# EAGLE design CORESP12 (EAGLE 6.5.0)
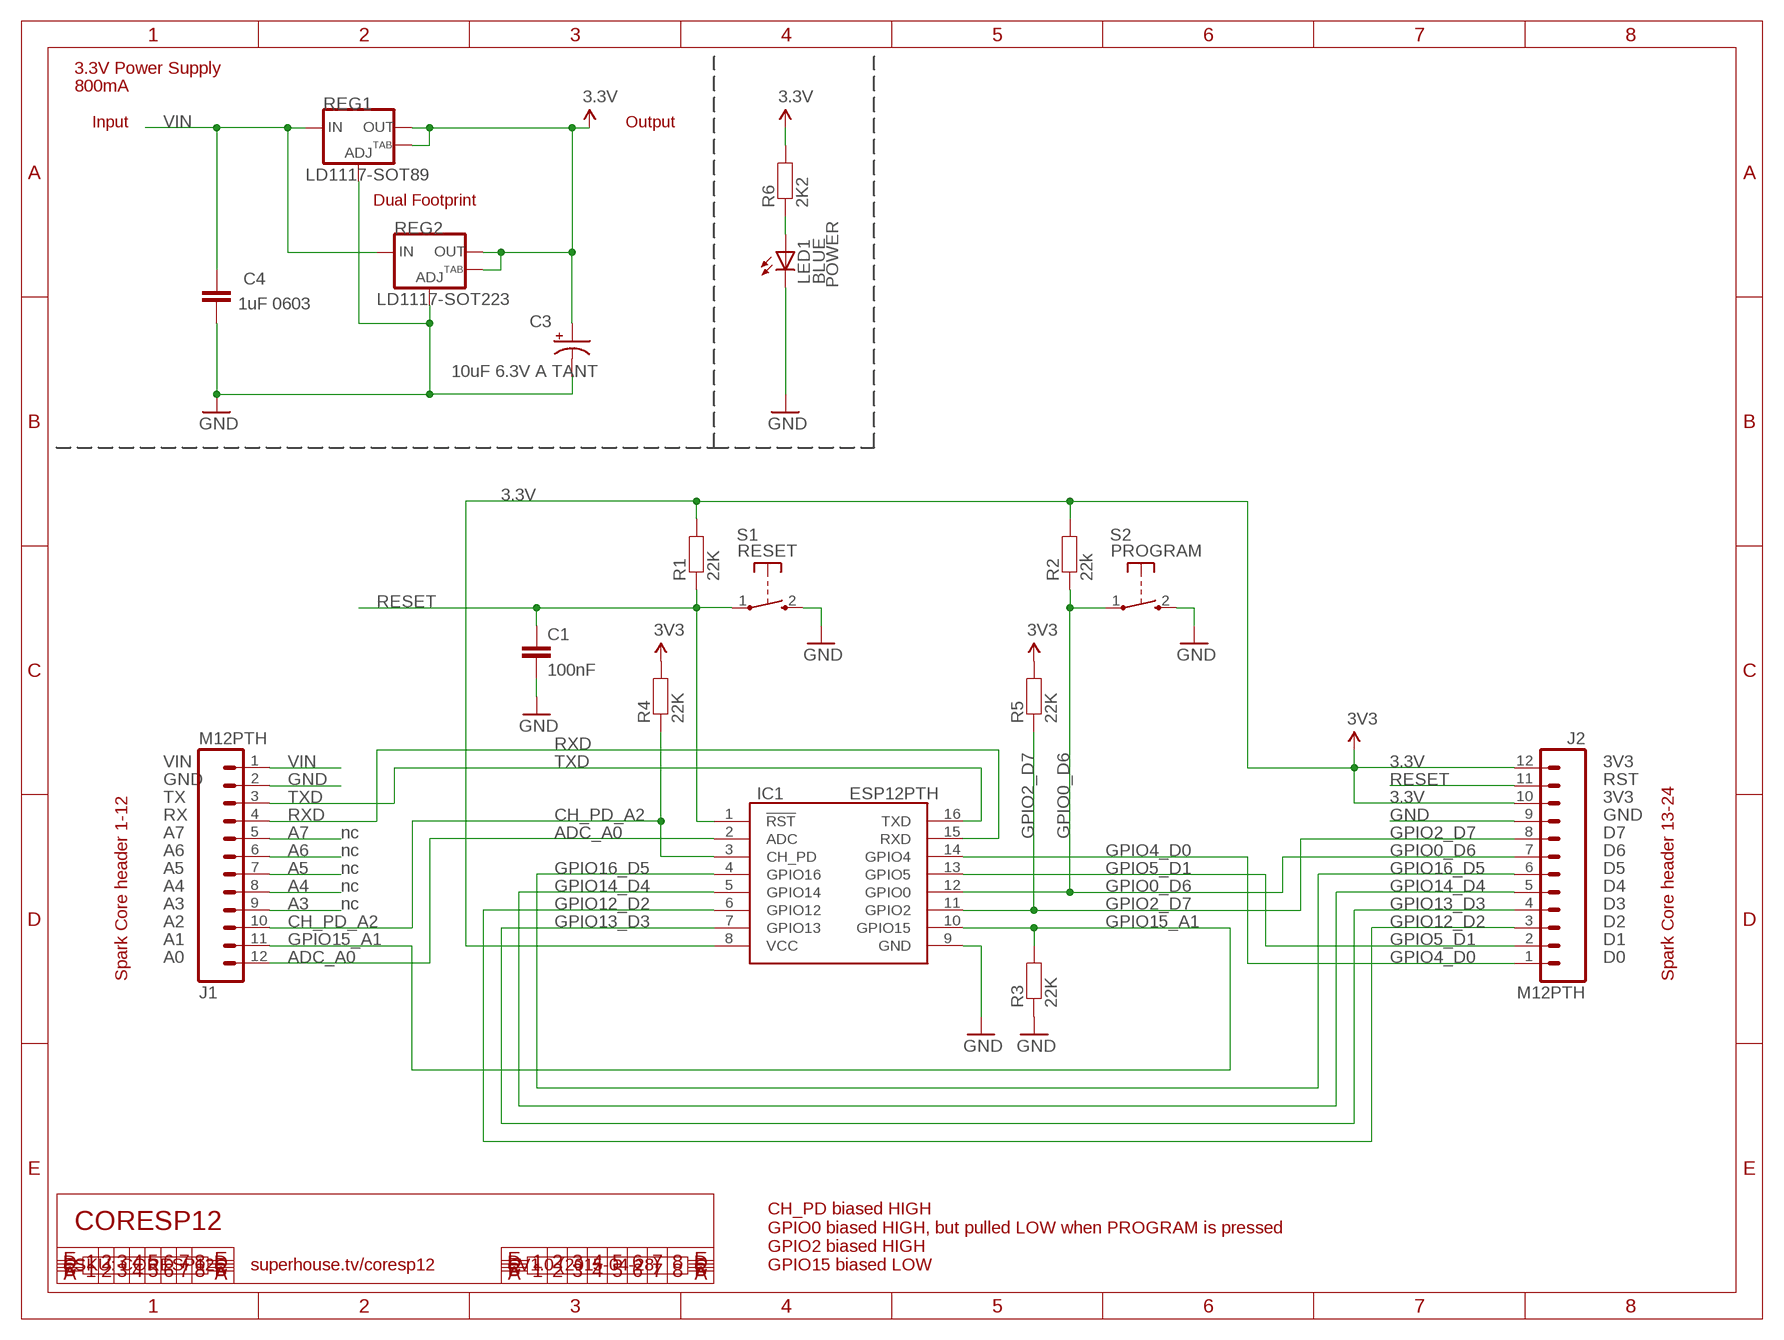
[diagram p0: schematic, sheet 1]

## Parts
C1  100nF  CAP0603  [0603]
C3  10uF 6.3V A TANT  CAP_POL1206  [EIA3216]
C4  1uF 0603  CAP0603  [0603]
IC1  ESP12PTH  [ESP12PTH]
J1  M12PTH  [1X12]
J2  M12PTH  [1X12]
LED1  BLUE  LED0603  [LED-0603]
R1  22K  RESISTOR0603  [0603]
R2  22k  RESISTOR0603  [0603]
R3  22K  RESISTOR0603  [0603]
R4  22K  RESISTOR0603  [0603]
R5  22K  RESISTOR0603  [0603]
R6  2K2  RESISTOR0603  [0603]
REG1  LD1117-SOT89  V_REG_LM1117SOT89  [SOT89]
REG2  LD1117-SOT223  V_REG_LM1117SOT223  [SOT223]
S1  RESET  TAC_SWITCH_2PIN  [TACTILE_SWITCH_SMD_2PIN_TINY]
S2  PROGRAM  TAC_SWITCH_2PIN  [TACTILE_SWITCH_SMD_2PIN_TINY]

## Nets
3.3V: C3.A(+) IC1.8(VCC) J2.10 J2.12 R1.2 R2.2 R4.2 R5.2 R6.2 REG1.2(OUT) REG1.4(OUT) REG2.2(OUT) REG2.4(OUT) ; supply symbol labelled 3V3
A3: J1.9
A4: J1.8
A5: J1.7
A6: J1.6
A7: J1.5
ADC_A0: IC1.2(ADC) J1.12
CH_PD_A2: IC1.3(CH_PD) J1.10 R4.1
GND: C1.2 C3.C(-) C4.2 IC1.9(GND) J1.2 J2.9 LED1.C R3.1 REG1.1(ADJ) REG2.1(ADJ) S1.2(S) S2.2(S)
GPIO0_D6: IC1.12(GPIO0) J2.7 R2.1 S2.1(P)
GPIO2_D7: IC1.11(GPIO2) J2.8 R5.1
GPIO4_D0: IC1.14(GPIO4) J2.1
GPIO5_D1: IC1.13(GPIO5) J2.2
GPIO12_D2: IC1.6(GPIO12) J2.3
GPIO13_D3: IC1.7(GPIO13) J2.4
GPIO14_D4: IC1.5(GPIO14) J2.5
GPIO15_A1: IC1.10(GPIO15) J1.11 R3.2
GPIO16_D5: IC1.4(GPIO16) J2.6
N$14: LED1.A R6.1
RESET: C1.1 IC1.1(!RST) J2.11 R1.1 S1.1(P)
RXD: IC1.15(RXD) J1.4
TXD: IC1.16(TXD) J1.3
VIN: C4.1 J1.1 REG1.3(IN) REG2.3(IN)

## Notes on the sheet
- 3.3V Power Supply
- 800mA
- Input | Output
- Dual Footprint
- POWER
- VIN | 3V3
- GND | RST
- TX | 3V3
- RX | GND
- A7 | nc | D7
- A6 | nc | D6
- A5 | nc | D5
- A4 | nc | D4
- A3 | nc | D3
- A2 | D2
- A1 | D1
- A0 | D0
- Spark Core header 1-12 | Spark Core header 13-24
- CORESP12
- SKU: CORESP12 | superhouse.tv/coresp12 | V1.0 (2015-04-28)
- CH_PD biased HIGH
  GPIO0 biased HIGH, but pulled LOW when PROGRAM is pressed
  GPIO2 biased HIGH
  GPIO15 biased LOW

## Library data of the parts
C1 = freetronics-master-v1.1:CAP: Capacitor Standard 0603 ceramic capacitor, and 0.1" leaded capacitor.
C3 = freetronics:CAP_POL: Capacitor Polarized These are standard SMD and PTH capacitors. Normally 10uF, 47uF, and 100uF in electrolytic and tantalum varieties. Always verify the external diameter of the through hole cap, it varies with capacity, voltage, and manufacturer. The EIA devices should be standard.
C4 = freetronics:CAP: Capacitor Standard 0603 ceramic capacitor, and 0.1" leaded capacitor.
IC1 = freetronics-jon:ESP12
J1 J2 = freetronics-original:M12: Header 12 Standard 12-pin 0.1" header. Use with straight break away headers (SKU : PRT-00116), right angle break away headers (PRT-00553), swiss pins (PRT-00743), machine pins (PRT-00117), and female headers (PRT-00115).
LED1 = freetronics-jon:LED: LEDs Standard schematic elements and footprints for 5mm, 3mm, 1206, and 0603 sized LEDs. 5mm - Spark Fun Electronics SKU : COM-00529 (and others)
R1-R5 = freetronics-master-v1.1:RESISTOR: Resistor Basic schematic elements and footprints for 0603, 1206, and PTH 1/10th watt (small) resistors.
R6 = freetronics-jon:RESISTOR: Resistor Basic schematic elements and footprints for 0603, 1206, and PTH 1/10th watt (small) resistors.
REG1 REG2 = freetronics:V_REG_LM1117: Voltage Regulator LD1117 Adjustable low-dropout voltage regulator available in SOT89 and SOT223 SMT packages.
S1 S2 = freetronics-jon:TAC_SWITCH_2PIN: Momentary Tactile Switch - 2 pin

## Net classes
0 Default: width 0.203 mm
1 VCC: width 0.305 mm

## Board
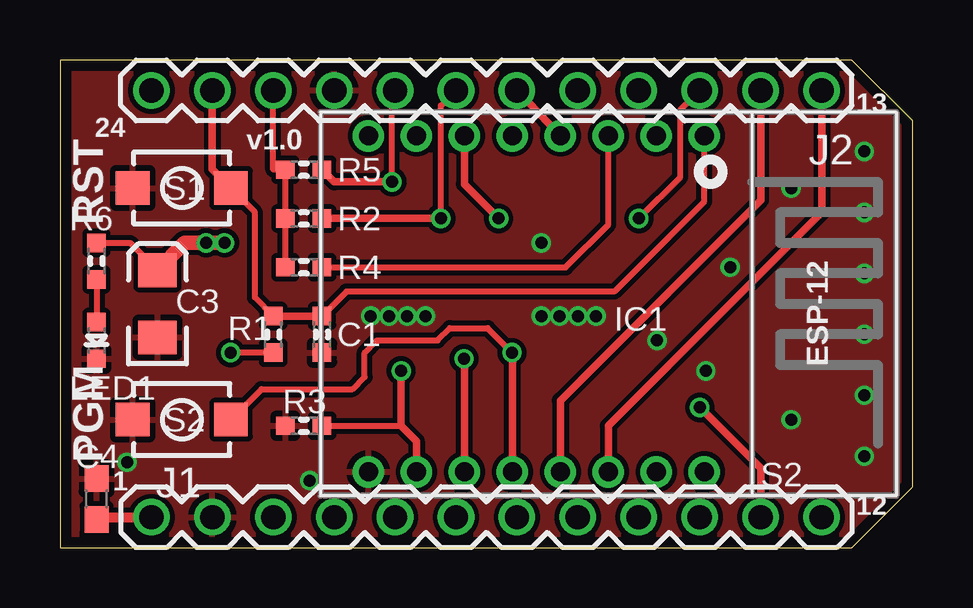
[diagram p1: board, top side]
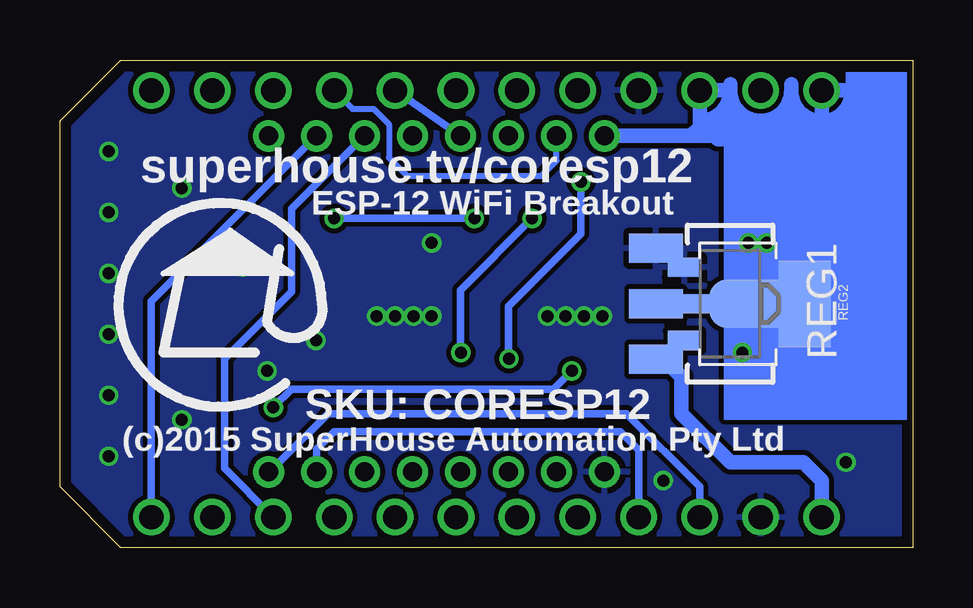
[diagram p2: board, bottom side, seen from below]

Size 35.56 x 20.32 mm. Coordinates in mm from the lower left corner, seen from the top.
Outline: 35.56,17.78 33.02,20.32 0,20.32 0,0 33.02,0 35.56,2.54 35.56,17.78
Copper layers (1*16): Top 0.035mm / dielectric 1.5mm / Bottom 0.035mm
Design rules "default": minimum track width 8mil, minimum drill 15mil, track to track 8mil, track to pad 8mil, pad to pad 8mil, via to via 8mil, smd to smd 8mil, copper to edge 18mil, drill to drill 8mil, minimum pad ring 10mil, minimum via ring 6mil, stop-mask expansion 4mil, vias tented up to drill 25mil, thermal gap 10mil

### Footprints (pad centres in the part's own frame; a part is rotated, then mirrored left to right if it is on the bottom)
0603 = smd 0.762 x 0.762: 1 -0.762,0; 2 0.762,0
EIA3216 = smd 1.4 x 1.6: A 1.4,0; C -1.4,0
0603' = smd 1.1 x 1: 1 -0.85,0; 2 0.85,0
ESP12PTH = drill 0.8: 1 -4,-7; 2 -2,-7; 3 0,-7; 4 2,-7; 5 4,-7; 6 6,-7; 7 8,-7; 8 10,-7; 9 10,7; 10 8,7; 11 6,7; 12 4,7; 13 2,7; 14 0,7; 15 -2,7; 16 -4,7
1X12 = drill 1.016: 1 0,0; 2 2.54,0; 3 5.08,0; 4 7.62,0; 5 10.16,0; 6 12.7,0; 7 15.24,0; 8 17.78,0; 9 20.32,0; 10 22.86,0; 11 25.4,0; 12 27.94,0
LED-0603 = smd 0.762 x 0.762: A -0.762,0; C 0.762,0
SOT89 = smd 0.8 x 1.4: 1 -1.524,-1.905; 3 1.524,-1.905 | smd 0.8 x 1.9: 2 0,-1.651 | smd 2.032 x 3.65: 4 0,0.94
SOT223 = smd 1.219 x 2.235: 1 -2.311,-3.099; 2 0,-3.099; 3 2.311,-3.099 | smd 3.6 x 2.2: 4 0,3.099
TACTILE_SWITCH_SMD_2PIN_TINY = smd 1.4 x 1.4: 1 -2.05,0; 2 2.05,0

### Placement (x,y rotation side)
C1  10.92,8.89 270 top
C3  4.06,10.16 90 top
C4  1uF 0603  [0603']  1.52,2.03 90 top
IC1  22.86,10.16 180 top
J1  3.81,1.27 0 top
J2  31.75,19.05 180 top
LED1  1.52,8.64 270 top
R1  8.89,8.89 270 top
R2  10.16,13.72 180 top
R3  10.16,5.08 0 top
R4  10.16,11.68 180 top
R5  10.16,15.75 180 top
R6  1.52,11.94 90 top
REG1  7.62,10.16 270 bottom
REG2  7.62,10.16 270 bottom
S1  5.08,14.99 180 top
S2  5.08,5.33 180 top

### Tracks (layer width: path | path; a pad name or v marks a point on that pad's centre or on a via)
3.3V  (via drill 0.5)
  Top 0.254: R6.2 2.92,12.7 C3.A | R4.2 R2.2 R5.2 8.89,15.75 J2.10 | R1.2 v7.11,8.13
  Top 0.61: C3.A 5.2,12.7 v6.1,12.7 v6.86,12.7
  Bottom 0.254: v7.11,8.13 7.11,9.91 7.37,10.16
  Bottom 0.305: 2.54,19.05 2.54,19.3
  Bottom 0.584: 3.81,17.78 arc-90 2.54,19.05
  Bottom 0.61: 3.81,17.78 J2.12 2.54,19.05 | 3.81,17.78 4.57,17.02 6.1,17.02 | 6.1,17.02 8.13,17.02 | 8.13,17.02 8.89,17.78 | 8.89,17.78 8.89,17.53 9.26,17.16 IC1.8 8.27,17.16 arc90 8.13,17.02 | 8.89,17.78 J2.10 7.62,19.05 | REG2.2 REG1.2 7.37,10.16 REG1.4 REG2.4 4.52,11.12 v6.1,12.7 6.1,17.02 | 3.81,17.78 arc90 5.08,19.05 | 5.08,19.3 5.08,19.05 | 5.08,19.05 arc90 6.35,17.78 arc90 7.62,19.05 | 7.62,19.3 7.62,19.05 | 7.62,19.05 arc90 8.89,17.78 | 8.89,17.78 8.38,17.78 arc90 7.87,17.27 7.87,17.53 arc90 7.37,18.03 7.37,17.53 5.59,17.53 arc-90 5.08,18.03 arc-90 4.57,17.53 4.83,17.53 arc-90 5.08,17.27
ADC_A0
  Bottom 0.305: IC1.2 31.75,10.27 J1.12
CH_PD_A2
  Top 0.254: R4.1 21.08,11.68 22.86,13.46 IC1.3
  Bottom 0.305: IC1.3 25.91,14.11 25.91,10.67 28.7,7.87 28.7,3.3 J1.10
GND  (via drill 0.5)
  other vias: 33.53,13.97 33.53,16.51 33.53,11.43 33.53,8.89 33.53,6.35 33.53,3.81 27.94,11.68 30.48,5.33 26.92,7.37 10.41,2.79 2.79,3.56 12.95,9.65 15.24,9.65 14.48,9.65 13.72,9.65 20.07,9.65 20.83,9.65 21.59,9.65 22.35,9.65 30.48,14.99 20.07,12.7 24.89,8.64
  pour Bottom: 35.56,17.78 35.56,2.54 33.02,0 0,0 0,20.32 33.02,20.32
  pour Top: 35.56,17.78 35.56,2.54 33.02,0 0,0 0,20.32 33.02,20.32
GPIO0_D6  (via drill 0.5)
  Top 0.254: v15.88,13.72 15.88,18.41 J2.7 | S2.1 8.4,6.6 12.19,6.6 12.7,7.11 12.7,8.13 13.21,8.64 15.75,8.64 16.26,9.14 17.83,9.14 v18.85,8.13
  Top 0.305: R2.1 v15.88,13.72 | IC1.12 18.86,8.37 v18.85,8.13
  Bottom 0.305: v15.88,13.72 18.86,10.73 18.86,8.45 v18.85,8.13
GPIO2_D7  (via drill 0.5)
  Top 0.254: v13.84,15.24 13.84,18.92 J2.8
  Top 0.305: IC1.11 16.86,7.85 v16.84,7.87 | v13.84,15.24 11.43,15.24 R5.1
  Bottom 0.305: v13.84,15.24 13.84,13.08 16.86,10.06 16.86,8.22 v16.84,7.87
GPIO4_D0
  Top 0.305: J2.1 31.75,13.97 22.86,5.08 IC1.14
GPIO5_D1
  Top 0.305: IC1.13 20.86,6.13 29.21,14.48 J2.2
GPIO12_D2  (via drill 0.5)
  Top 0.254: J2.3 25.86,18.24 25.86,15.44 v24.13,13.72
  Top 0.305: IC1.6 16.86,15.14 v18.29,13.72
  Bottom 0.305: v18.29,13.72 v24.13,13.72
GPIO13_D3
  Bottom 0.254: J2.4 23.37,18.29 22.48,18.29 21.84,17.65 21.84,16.26 21.08,15.49 15.49,15.49 14.86,16.13 IC1.7
GPIO14_D4
  Bottom 0.305: IC1.5 J2.5
GPIO15_A1  (via drill 0.5)
  Top 0.254: R3.2 14.22,5.08
  Top 0.305: IC1.10 14.86,4.44 14.22,5.08 v14.22,7.37 | J1.11 29.21,3.3 v26.67,5.84
  Bottom 0.305: v26.67,5.84 25.91,6.6 14.99,6.6 v14.22,7.37
GPIO16_D5
  Top 0.305: J2.6 IC1.4
N$14
  Top 0.254: R6.1 LED1.A
RESET
  Top 0.254: IC1.1 26.86,14.41 23.11,10.67 11.94,10.67 C1.1 | R1.1 8.13,10.41 8.13,13.97 7.13,14.97 S1.1
  Top 0.305: C1.1 R1.1 | J2.11 6.35,15.77 S1.1
RXD
  Bottom 0.305: J1.4 11.43,4.06 12.19,4.83 24.13,4.83 24.86,4.1 IC1.15
TXD
  Bottom 0.305: J1.3 8.89,2.54 11.94,5.59 24.38,5.59 26.35,3.62 IC1.16
VIN
  Top 0.406: 1.36,1.27 J1.1
  Top 0.61: C4.1 1.36,1.27
  Bottom 0.254: REG2.3 9.93,8.64 REG1.3
  Bottom 0.61: J1.1 3.81,2.79 4.57,3.56 7.62,3.56 9.65,5.59 9.65,7.11 10.39,7.85 REG2.3
(copper drawn outside any net)
  shapes: Bottom area x3

### Text on the board
tPlace: 13 | 24 | v1.0 | RST | ESP-12 | PGM | 1 | 12
bPlace: superhouse.tv/coresp12 | ESP-12 WiFi Breakout | SKU: CORESP12 | (c)2015 SuperHouse Automation Pty Ltd
tNames: S1 | S2 | S2
tDocu: A | A | K | K